# EAGLE design schematic (EAGLE 9.4.0)
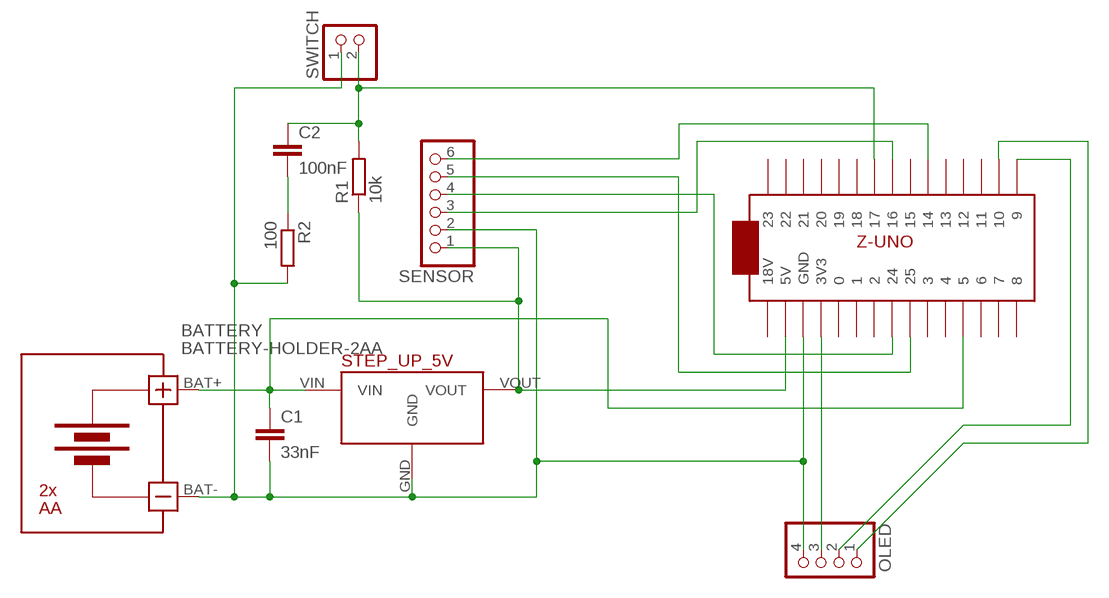
[diagram p0: schematic, sheet 1]

## Parts
BATTERY  BATTERY-HOLDER-2AA  [BATTERY-HOLDER-2AA]
C1  33nF  C-EU025-024X044  [C025-024X044]
C2  100nF  C-EU025-024X044  [C025-024X044]
OLED  PINHD-1X4  [1X04]
R1  10k  R-EU_0204/7  [0204/7]
R2  100  R-EU_0204/7  [0204/7]
SENSOR  PINHD-1X6  [1X06]
STEP_UP_5V  5V_VOLTAGE_REGULATOR  [5V_VOLTAGE_REGULATOR]
SWITCH  PINHD-1X2  [1X02]
ZUNO  ZUNO  [ZUNO]

## Nets
GND: BATTERY.BAT- C1.2 OLED.4 R2.2 SENSOR.2 STEP_UP_5V.GND SWITCH.1 ZUNO.P$3(GND)
INT0: C2.1 R1.2 SWITCH.2 ZUNO.P$24
RESET: SENSOR.6 ZUNO.P$21
RX: SENSOR.4 ZUNO.P$8
SCL: OLED.2 ZUNO.P$16
SDA: OLED.1 ZUNO.P$17
SET: SENSOR.3 ZUNO.P$23
SW: C2.2 R2.1
TX: SENSOR.5 ZUNO.P$9
V3V: OLED.3 ZUNO.P$4(3V3)
V5V: R1.1 SENSOR.1 STEP_UP_5V.VOUT ZUNO.P$2(5V)
VIN: BATTERY.BAT+ C1.1 STEP_UP_5V.VIN ZUNO.P$12
Unconnected: ZUNO.P$1(18V) ZUNO.P$5 ZUNO.P$6 ZUNO.P$7 ZUNO.P$10 ZUNO.P$11 ZUNO.P$13 ZUNO.P$14 ZUNO.P$15 ZUNO.P$18 ZUNO.P$19 ZUNO.P$20 ZUNO.P$22 ZUNO.P$25 ZUNO.P$26 ZUNO.P$27 ZUNO.P$28 ZUNO.P$29 ZUNO.P$30

## Library data of the parts
BATTERY = diy-modules:BATTERY-HOLDER-2AA: Battery Holder 2 x AA Click here to find device on ebay.com <http://www.ebay.com/sch/battery+plastic+holder+aa+2x1.5v>
C1 C2 = rcl:C-EU: CAPACITOR, European symbol; SPICEPREFIX: C
OLED = pinhead:PINHD-1X4: PIN HEADER
R1 R2 = rcl:R-EU_: RESISTOR, European symbol; SPICEPREFIX: R
SENSOR = pinhead:PINHD-1X6: PIN HEADER
STEP_UP_5V = Pololu Voltage Regulators:5V_VOLTAGE_REGULATOR: Polulu 5V Step-Up/Step-Down Voltage REgulator S7V7F5
SWITCH = pinhead:PINHD-1X2: PIN HEADER
ZUNO = adafruit:ZUNO

## Board
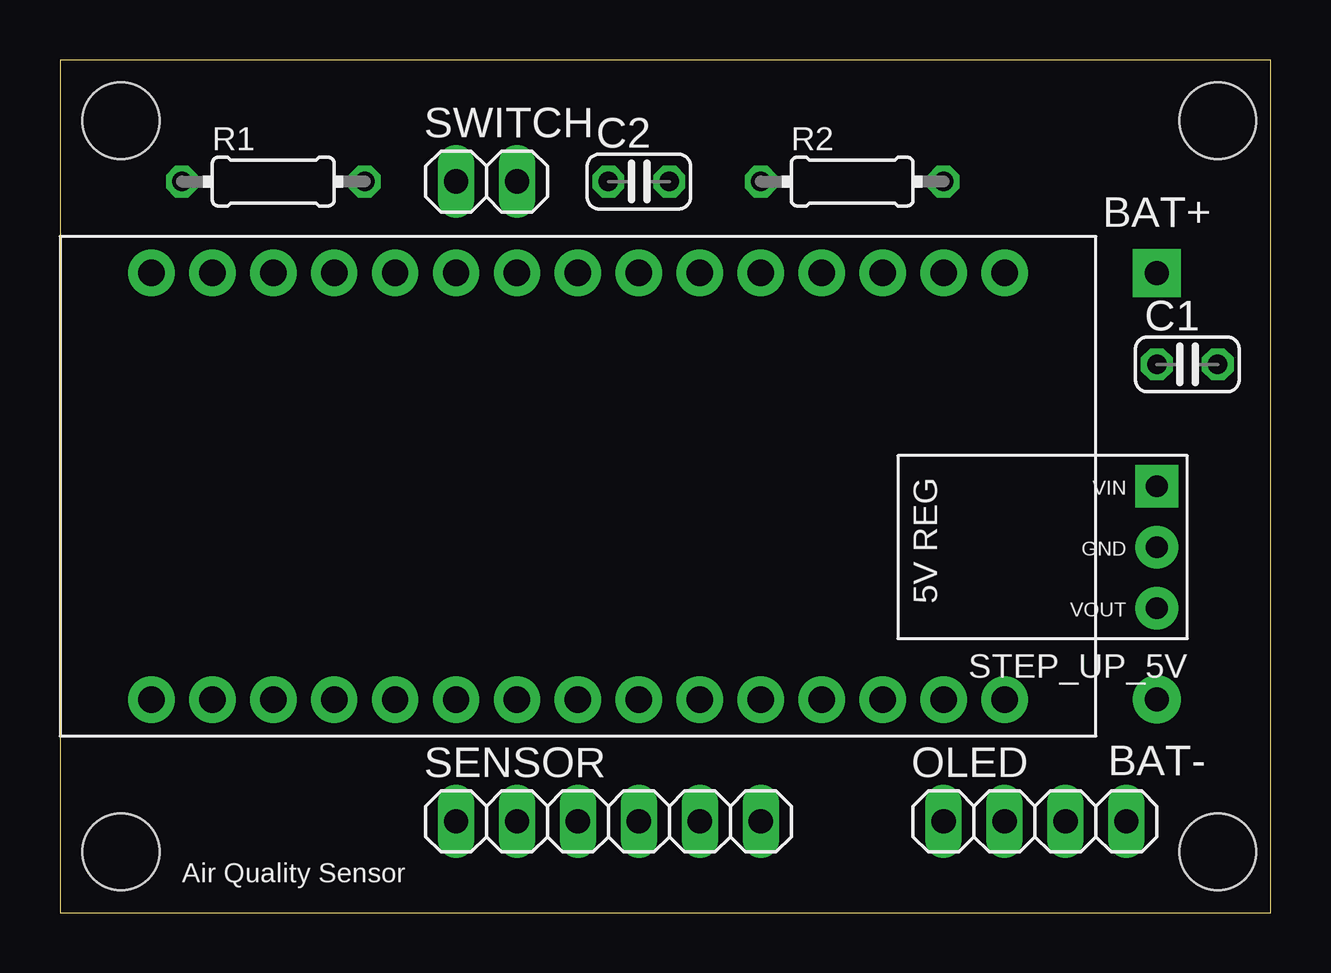
[diagram p1: board, top side]
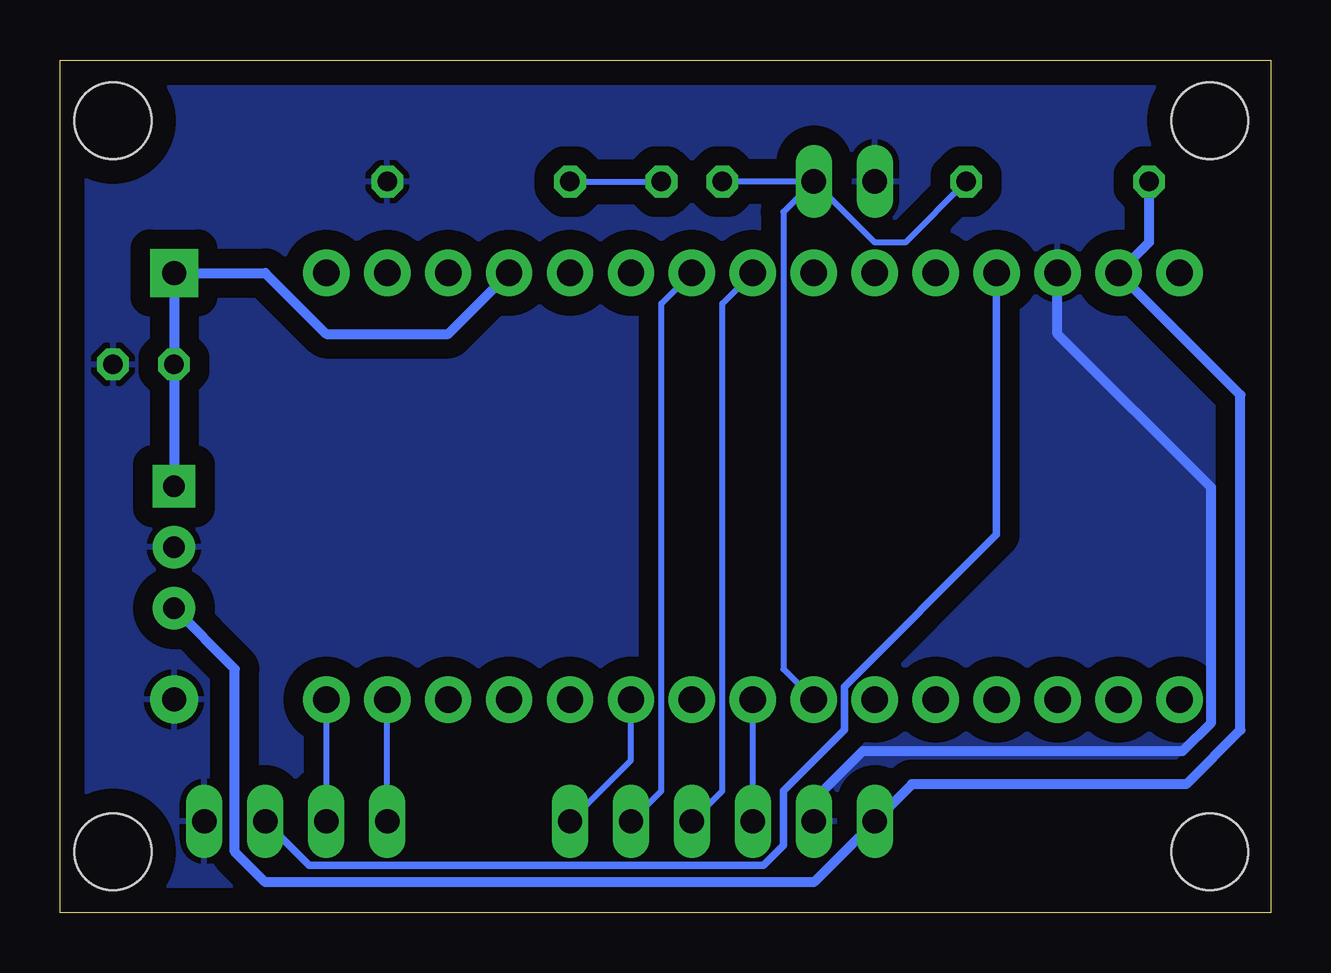
[diagram p2: board, bottom side, seen from below]

Size 50.47 x 35.55 mm. Coordinates in mm from the lower left corner, seen from the top.
Outline: 0,0 50.47,0 50.47,35.55 0,35.55 0,0
Copper layers (1*16): Top 0.035mm / dielectric 1.5mm / Bottom 0.035mm
Design rules "default": minimum track width 6mil, minimum drill 0.35mm, track to track 6mil, track to pad 6mil, pad to pad 6mil, via to via 6mil, smd to smd 6mil, copper to edge 40mil, drill to drill 6mil, minimum pad ring 10mil, minimum via ring 8mil, stop-mask expansion 4mil, vias tented up to drill 0mil, thermal gap 10mil
Holes 3.2 mm at 2.54,2.54 48.26,33.02 2.54,33.02 48.26,2.54

### Footprints (pad centres in the part's own frame; a part is rotated, then mirrored left to right if it is on the bottom)
BATTERY-HOLDER-2AA = drill 1 pad 2 square: BAT+ 0,8.89 | drill 1 pad 2: BAT- 0,-8.89
C025-024X044 = drill 0.813 octagon: 1 -1.27,0; 2 1.27,0
1X04 = drill 1.016 long: 1 -3.81,0; 2 -1.27,0; 3 1.27,0; 4 3.81,0
0204/7 = drill 0.813 octagon: 1 -3.81,0; 2 3.81,0
1X06 = drill 1.016 long: 1 -6.35,0; 2 -3.81,0; 3 -1.27,0; 4 1.27,0; 5 3.81,0; 6 6.35,0
5V_VOLTAGE_REGULATOR = drill 0.9 pad 1.778: GND 0,-6.35; VOUT -2.54,-6.35 | drill 0.9 pad 1.778 square: VIN 2.54,-6.35
1X02 = drill 1.016 long: 1 -1.27,0; 2 1.27,0
ZUNO = drill 1.1 pad 1.93: P$1 -20.32,7.62; P$2 -17.78,7.62; P$3 -15.24,7.62; P$4 -12.7,7.62; P$5 -10.16,7.62; P$6 -7.62,7.62; P$7 -5.08,7.62; P$8 -2.54,7.62; P$9 0,7.62; P$10 2.54,7.62; P$11 5.08,7.62; P$12 7.62,7.62; P$13 10.16,7.62; P$14 12.7,7.62; P$15 15.24,7.62; P$16 15.24,-10.16; P$17 12.7,-10.16; P$18 10.16,-10.16; P$19 7.62,-10.16; P$20 5.08,-10.16; P$21 2.54,-10.16; P$22 0,-10.16; P$23 -2.54,-10.16; P$24 -5.08,-10.16; P$25 -7.62,-10.16; P$26 -10.16,-10.16; P$27 -12.7,-10.16; P$28 -15.24,-10.16; P$29 -17.78,-10.16; P$30 -20.32,-10.16

### Placement (x,y rotation side)
BATTERY  45.72,17.78 0 top
C1  46.99,22.86 0 top
C2  24.13,30.48 0 top
OLED  40.64,3.81 0 top
R1  8.89,30.48 0 top
R2  33.02,30.48 0 top
SENSOR  22.86,3.81 0 top
STEP_UP_5V  39.37,15.24 90 top
SWITCH  17.78,30.48 0 top
ZUNO  24.13,19.05 0 top

### Tracks (layer width: path | path; a pad name or v marks a point on that pad's centre or on a via)
GND
  Bottom 0.406: ZUNO.P$3 8.89,24.13 2.49,17.73 2.49,7.92 3.68,6.73 17.02,6.73 19.05,4.7 SENSOR.2
  pour Bottom (isolate 0.813): 0,0 50.8,0 50.8,35.56 0,35.56
INT0
  Bottom 0.254: SWITCH.2 C2.1 | SWITCH.2 16.51,27.94 15.24,27.94 R1.2 | SWITCH.2 20.32,29.21 20.32,10.16 ZUNO.P$24
RESET
  Bottom 0.254: SENSOR.6 26.67,6.35 ZUNO.P$21
RX
  Bottom 0.254: SENSOR.4 22.86,5.08 22.86,25.4 ZUNO.P$8
SCL
  Bottom 0.254: ZUNO.P$16 OLED.2
SDA
  Bottom 0.254: OLED.1 ZUNO.P$17
SET
  Bottom 0.254: SENSOR.3 ZUNO.P$23
SW
  Bottom 0.254: R2.1 C2.2
TX
  Bottom 0.254: SENSOR.5 25.4,5.08 25.4,25.4 ZUNO.P$9
V3V
  Bottom 0.305: OLED.3 40.08,1.98 21.15,1.98 20.32,2.81 20.32,5.08 17.78,7.62 17.78,9.42 11.43,15.77 ZUNO.P$4
V5V
  Bottom 0.406: R1.1 5.08,27.94 ZUNO.P$2 1.27,21.59 1.27,7.62 3.53,5.36 14.96,5.36 SENSOR.1 19.05,1.27 41.91,1.27 43.18,2.54 43.18,10.16 STEP_UP_5V.VOUT
VIN
  Bottom 0.406: STEP_UP_5V.VIN C1.1 BATTERY.BAT+ 41.91,26.67 39.37,24.13 34.29,24.13 ZUNO.P$12

### Text on the board
tPlace: Air Quality Sensor